# EAGLE design clock14 (EAGLE 7.7.0)
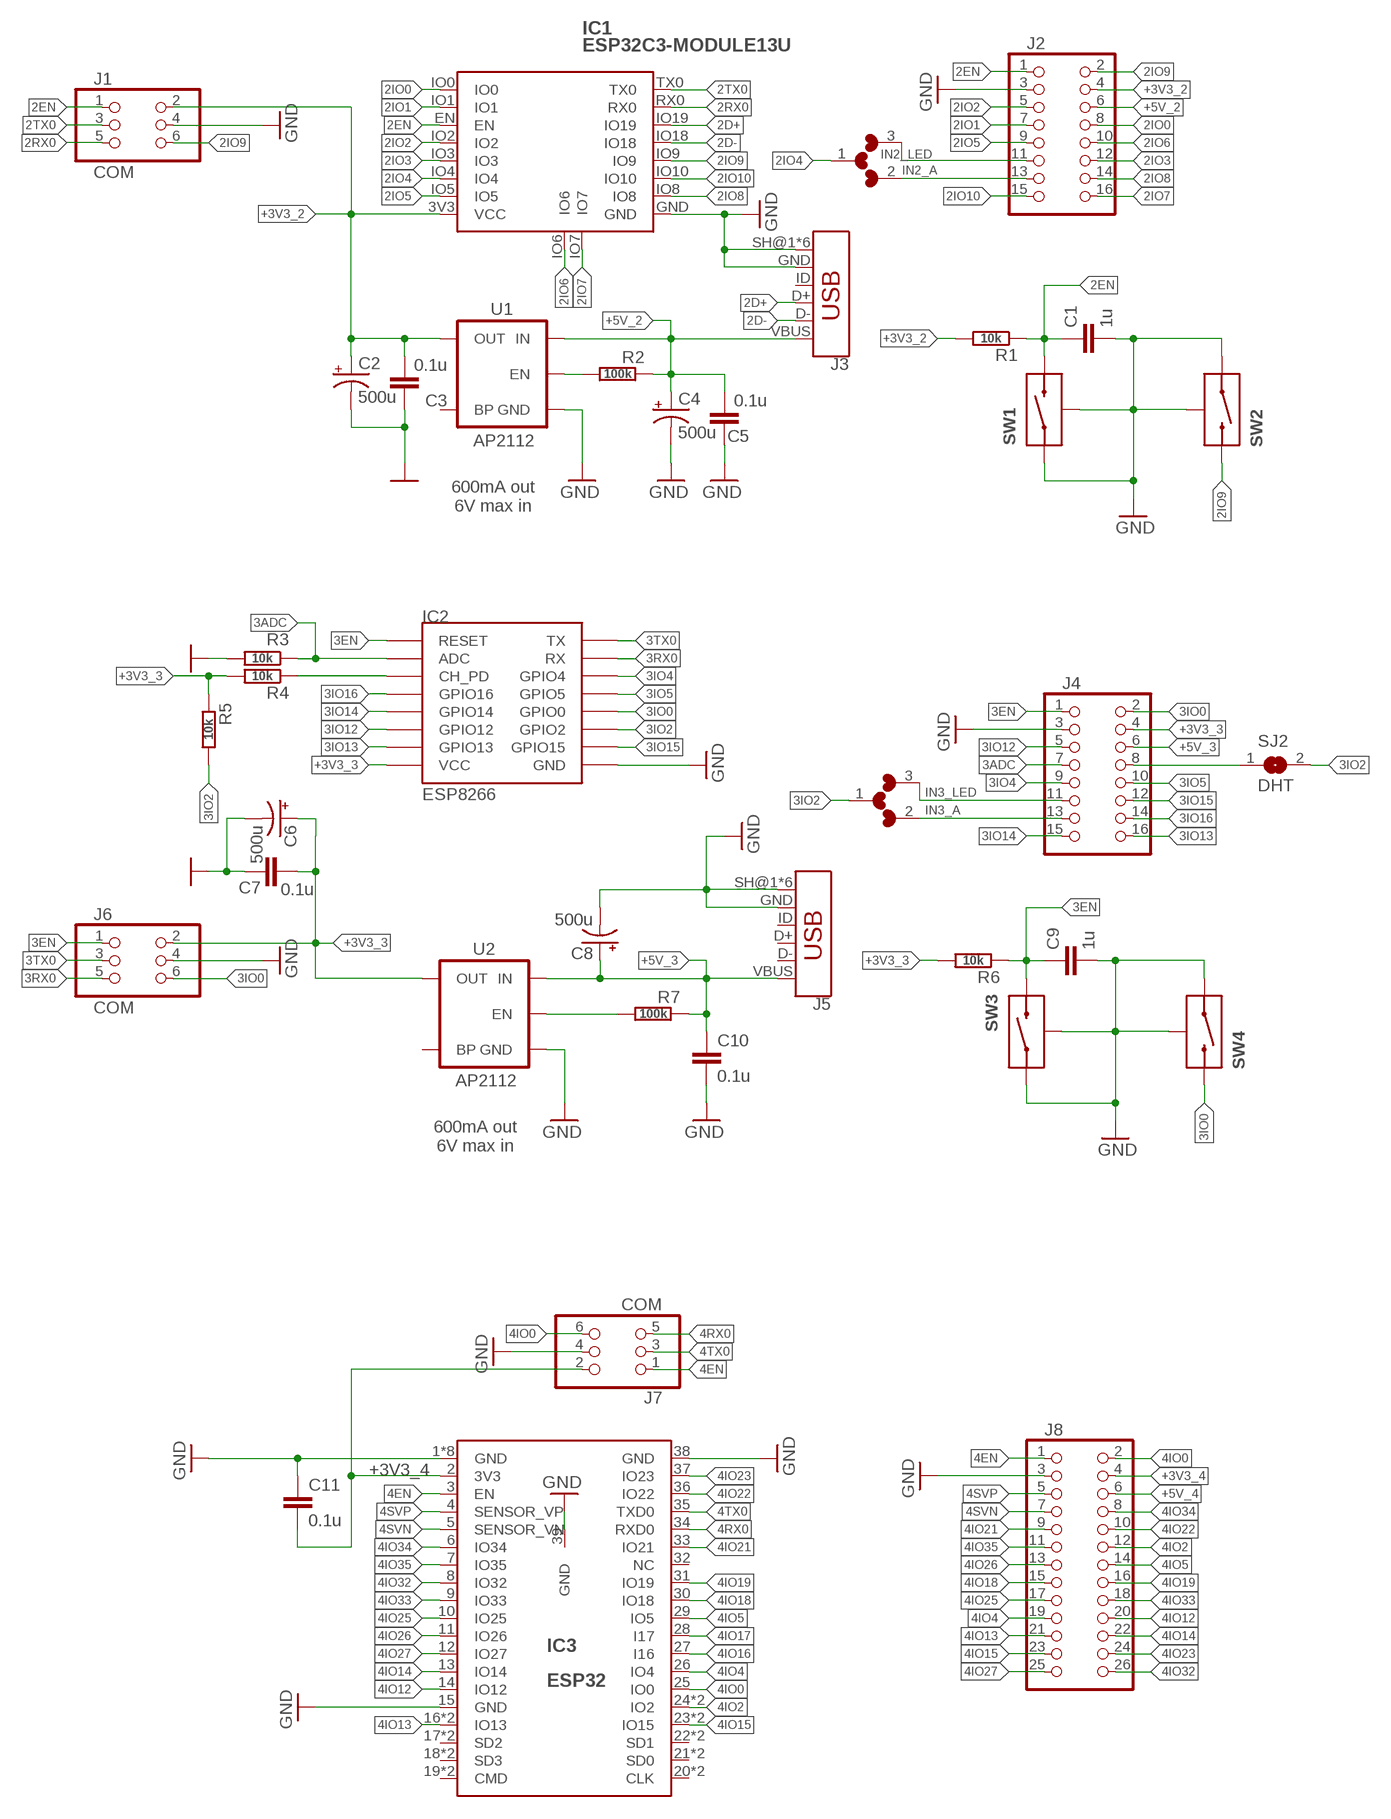
[diagram p0: schematic, sheet 1, part 1 of 2]
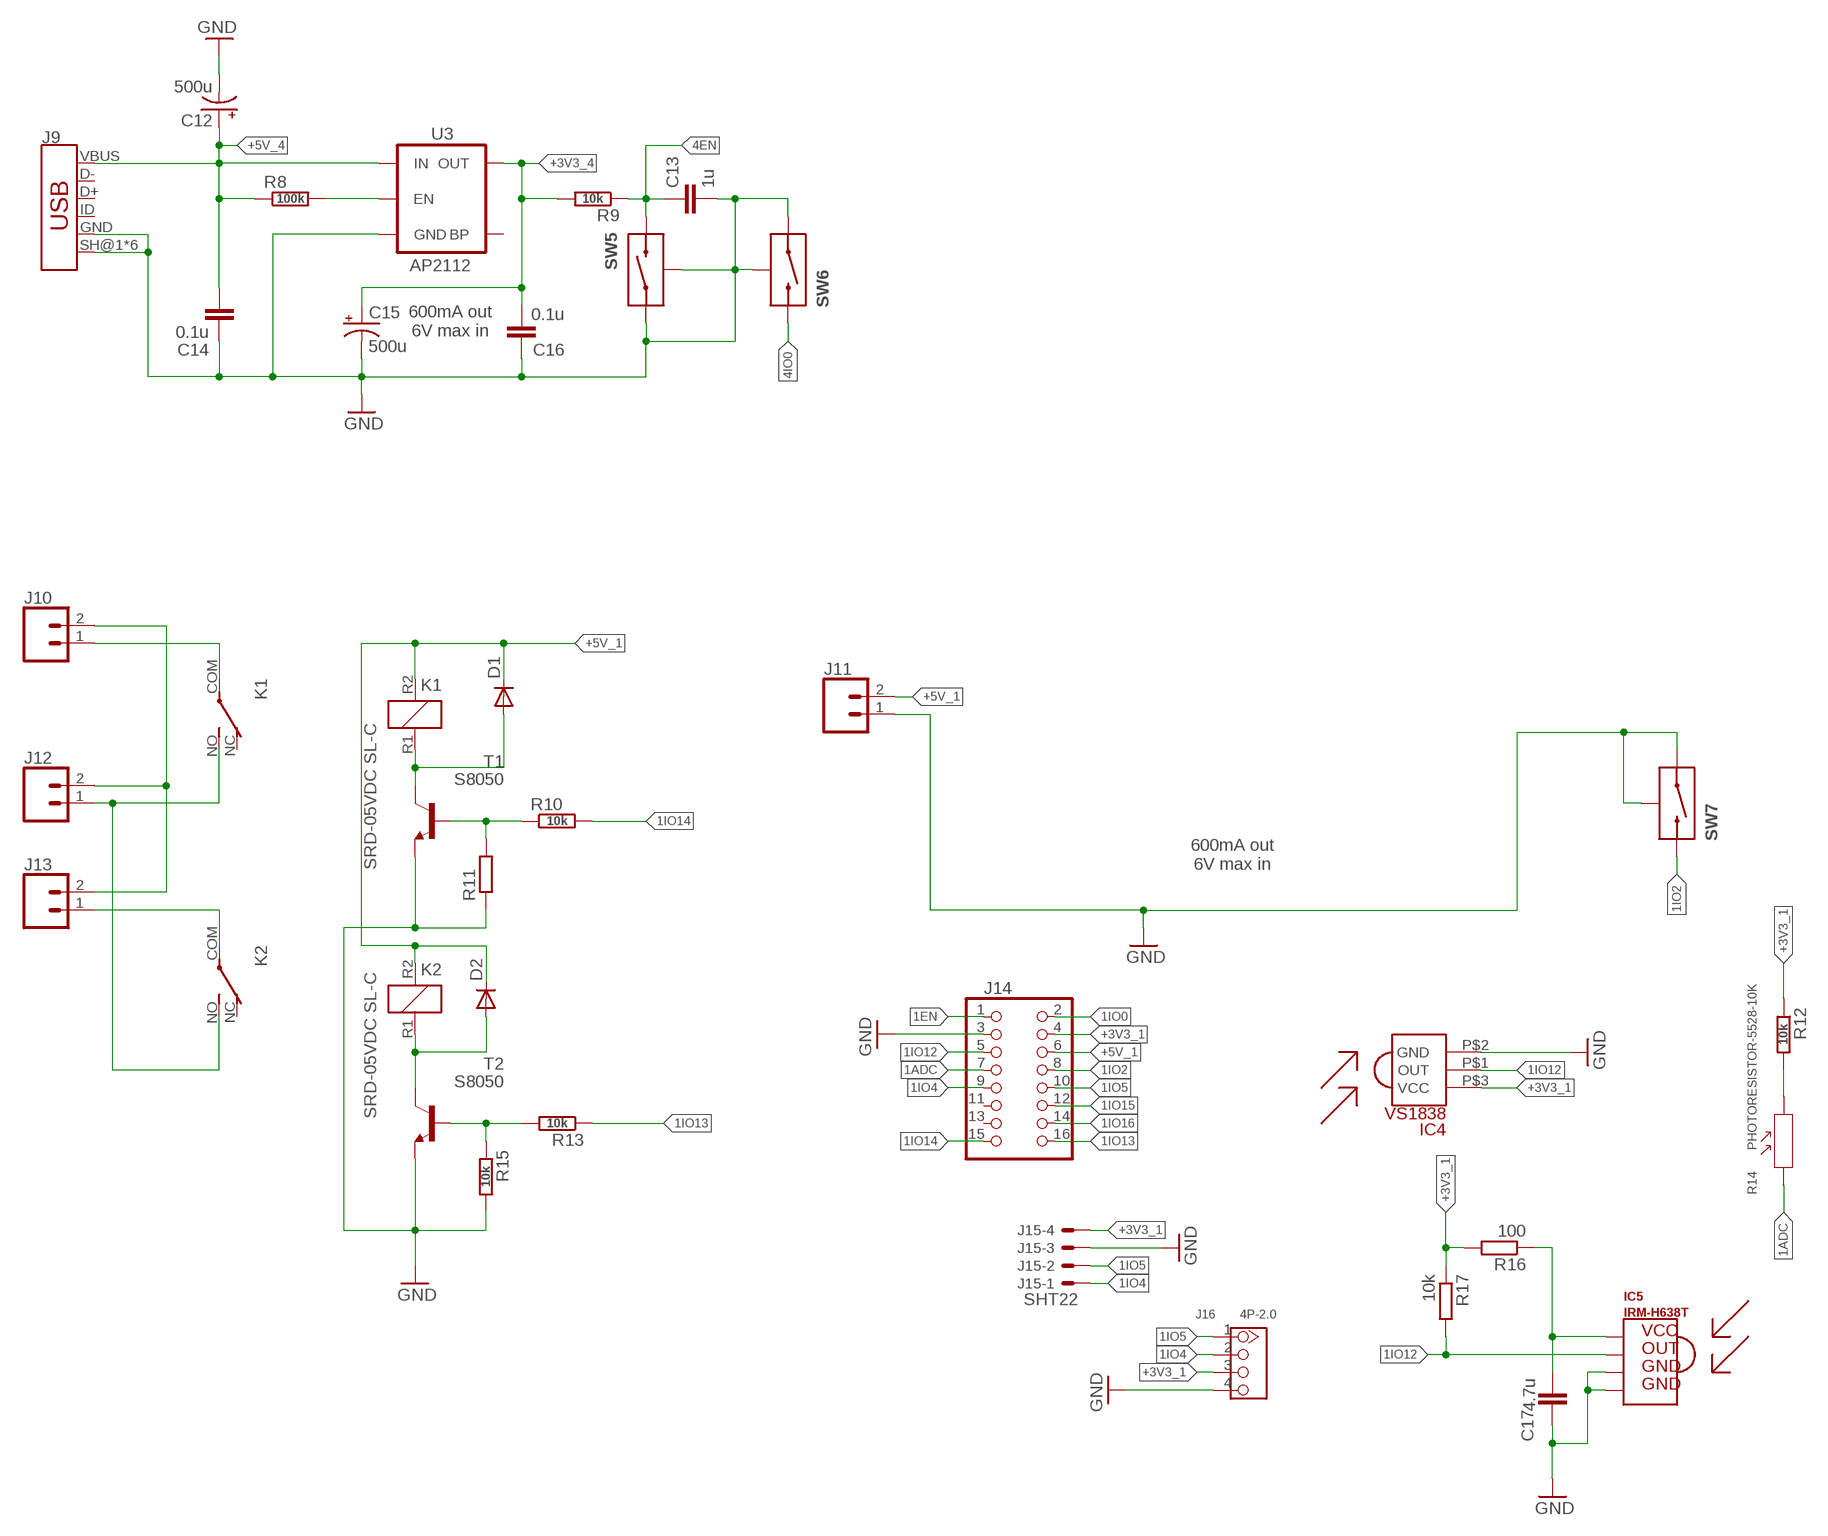
[diagram p1: schematic, sheet 1, part 2 of 2]

## Parts
C1  1u  CAP0603-CAP  [0603-CAP]
C2  500u  CAP_POLPTH1  [CPOL-RADIAL-100UF-25V]
C3  0.1u  CAP0603-CAP  [0603-CAP]
C4  500u  CAP_POLPTH1  [CPOL-RADIAL-100UF-25V]
C5  0.1u  CAP0603-CAP  [0603-CAP]
C6  500u  CAP_POLPTH1  [CPOL-RADIAL-100UF-25V]
C7  0.1u  CAP0603-CAP  [0603-CAP]
C8  500u  CAP_POLPTH1  [CPOL-RADIAL-100UF-25V]
C9  1u  CAP0603-CAP  [0603-CAP]
C10  0.1u  CAP0603-CAP  [0603-CAP]
C11  0.1u  CAP0603-CAP  [0603-CAP]
C12  500u  CAP_POLPTH1  [CPOL-RADIAL-100UF-25V]
C13  1u  CAP0603-CAP  [0603-CAP]
C14  0.1u  CAP0603-CAP  [0603-CAP]
C15  500u  CAP_POLPTH1  [CPOL-RADIAL-100UF-25V]
C16  0.1u  CAP0603-CAP  [0603-CAP]
C17  4.7u  CAP0603-CAP  [0603-CAP]
D1  DIODE-SOD123  [SOD123]
D2  DIODE-SOD123  [SOD123]
IC1  ESP32C3-MODULE13U  [ESP32C3-13U]
IC2  ESP8266  ESP12SMD  [ESP12-SMD]
IC3  ESP32  ESP32-MODULEDUAL  [ESP32-WROOVER/WROOM]
IC4  VS1838  [IR]
IC5  IRM-H638T  [IRM-H638T]
J1  COM  HEADER-2X3SMT  [2X03_SMT]
J2  HEADER-2X8  [2X8]
J3  USB_MICRO-BFEMALE_SMT_  [USB-B-MICRO-SMD_MY]
J4  HEADER-2X8  [2X8]
J5  USB_MICRO-BFEMALE_SMT_  [USB-B-MICRO-SMD_MY]
J6  COM  HEADER-2X3SMT  [2X03_SMT]
J7  COM  HEADER-2X3SMT  [2X03_SMT]
J8  HEADER-2X13  [2X13]
J9  USB_MICRO-BFEMALE_SMT_  [USB-B-MICRO-SMD_MY]
J10  CONN_02  [1X02]
J11  CONN_02  [1X02]
J12  CONN_02  [1X02]
J13  CONN_02  [1X02]
J14  HEADER-2X8  [2X8]
J15  SHT22  C-GRID-04-70543  [70543-04]
J16  4P-2.0  GROVE-CONNECTOR-DIP(4P-2.0)  [HW4-2.0]
K1  SRD-05VDC SL-C  CB1A-P-12V  [SL-C]
K2  SRD-05VDC SL-C  CB1A-P-12V  [SL-C]
R1  10k  R-EU_R0603  [R0603]
R2  100k  R-EU_R0603  [R0603]
R3  10k  R-EU_R0603  [R0603]
R4  10k  R-EU_R0603  [R0603]
R5  10k  R-EU_R0603  [R0603]
R6  10k  R-EU_R0603  [R0603]
R7  100k  R-EU_R0603  [R0603]
R8  100k  R-EU_R0603  [R0603]
R9  10k  R-EU_R0603  [R0603]
R10  10k  R-EU_R0603  [R0603]
R11  R-EU_R0603  [R0603]
R12  10k  R-EU_R0603  [R0603]
R13  10k  R-EU_R0603  [R0603]
R14  PHOTORESISTOR-5528-10K  PHOTORESISTOR-5528-10K(2P-5.0X4.2MM)  [SNR2-3.0]
R15  10k  R-EU_R0603  [R0603]
R16  100  R-EU_R0603  [R0603]
R17  10k  R-EU_R0603  [R0603]
SJ1  L/W  MICROBUILDER_SOLDERJUMPER3  [MICROBUILDER_SOLDERJUMPER_ARROW_NOPASTE_3]
SJ2  DHT  MICROBUILDER_SOLDERJUMPER  [MICROBUILDER_SOLDERJUMPER_ARROW_NOPASTE]
SJ3  L/W  MICROBUILDER_SOLDERJUMPER3  [MICROBUILDER_SOLDERJUMPER_ARROW_NOPASTE_3]
SW1  RST  MICROSWITCH-BUTTON  [MICROPUSH-BUT_TOP]
SW2  PRG  MICROSWITCH-BUTTON  [MICROPUSH-BUT_TOP]
SW3  RST  MICROSWITCH-BUTTON  [MICROPUSH-BUT_TOP]
SW4  PRG  MICROSWITCH-BUTTON  [MICROPUSH-BUT_TOP]
SW5  RST  MICROSWITCH-BUTTON  [MICROPUSH-BUT_TOP]
SW6  PRG  MICROSWITCH-BUTTON  [MICROPUSH-BUT_TOP]
SW7  PRG  MICROSWITCH-BUTTON  [MICROPUSH-BUT_TOP]
T1  S8050  -NPN-SOT23-EBC  [SOT23-EBC]
T2  S8050  -NPN-SOT23-EBC  [SOT23-EBC]
U1  AP2112  V_REG_LDOSMD  [SOT23-5]
U2  AP2112  V_REG_LDOSMD  [SOT23-5]
U3  AP2112  V_REG_LDOSMD  [SOT23-5]

## Nets
1ADC: J14.7 R14.1
1EN: J14.1
1EN_P: R8.2 U3.3(EN)
1IO0: J14.2
1IO2: J14.8 SW7.B
1IO4: J14.9 J15.1 J16.2
1IO5: J14.10 J15.2 J16.1
1IO12: IC4.P$1(OUT) IC5.OUT J14.5 R17.2
1IO13: J14.16 R13.1
1IO14: J14.15 R10.2
1IO15: J14.12
1IO16: J14.14
2D+: IC1.IO19 J3.D+
2D-: IC1.IO18 J3.D-
2EN: C1.1 IC1.EN J1.1 J2.1 R1.1 SW1.B
2EN_P: R2.2 U1.3(EN)
2IO0: IC1.IO0 J2.8
2IO1: IC1.IO1 J2.7
2IO2: IC1.IO2 J2.5
2IO3: IC1.IO3 J2.12
2IO4: IC1.IO4 SJ1.1
2IO5: IC1.IO5 J2.9
2IO6: IC1.IO6 J2.10
2IO7: IC1.IO7 J2.16
2IO8: IC1.IO8 J2.14
2IO9: IC1.IO9 J1.6 J2.2 SW2.B
2IO10: IC1.IO10 J2.15
2RX0: IC1.RX0 J1.5
2TX0: IC1.TX0 J1.3
3ADC: IC2.ADC J4.7 R3.1
3EN: C9.1 IC2.RESET J4.1 J6.1 R6.1 SW3.B
3EN_P: R7.2 U2.3(EN)
3IO0: IC2.GPIO0 J4.2 J6.6 SW4.B
3IO2: IC2.GPIO2 R5.2 SJ2.2 SJ3.1
3IO4: IC2.GPIO4 J4.9
3IO5: IC2.GPIO5 J4.10
3IO12: IC2.GPIO12 J4.5
3IO13: IC2.GPIO13 J4.16
3IO14: IC2.GPIO14 J4.15
3IO15: IC2.GPIO15 J4.12
3IO16: IC2.GPIO16 J4.14
3RX0: IC2.RXD0(RX) J6.5
3TX0: IC2.TXD0(TX) J6.3
4EN: C13.1 IC3.3(EN) J7.1 J8.1 R9.1 SW5.B
4IO0: IC3.25(IO0) J7.6 J8.2 SW6.B
4IO2: IC3.24(IO2) IC3.48(IO2) J8.12
4IO4: IC3.26(IO4) J8.19
4IO5: IC3.29(IO5) J8.14
4IO12: IC3.14(IO12) J8.20
4IO13: IC3.16(IO13) IC3.40(IO13) J8.21
4IO14: IC3.13(IO14) J8.22
4IO15: IC3.23(IO15) IC3.47(IO15) J8.23
4IO16: IC3.27(I16)
4IO17: IC3.28(I17)
4IO18: IC3.30(IO18) J8.15
4IO19: IC3.31(IO19) J8.16
4IO21: IC3.33(IO21) J8.9
4IO22: IC3.36(IO22) J8.10
4IO23: IC3.37(IO23) J8.24
4IO25: IC3.10(IO25) J8.17
4IO26: IC3.11(IO26) J8.13
4IO27: IC3.12(IO27) J8.25
4IO32: IC3.8(IO32) J8.26
4IO33: IC3.9(IO33) J8.18
4IO34: IC3.6(IO34) J8.8
4IO35: IC3.7(IO35) J8.11
4RX0: IC3.34(RXD0) J7.5
4SVN: IC3.5(SENSOR_VN) J8.7
4SVP: IC3.4(SENSOR_VP) J8.5
4TX0: IC3.35(TXD0) J7.3
+3V3_1: IC4.P$3(VCC) J14.4 J15.4 J16.3 R12.1 R16.2 R17.1
+3V3_2: C2.1(+) C3.2 IC1.3V3(VCC) J1.2 J2.4 R1.2 U1.5(OUT)
+3V3_3 [power]: C6.1(+) C7.2 IC2.VCC J4.4 J6.2 R4.2 R5.1 R6.2 U2.5(OUT)
+3V3_4: C11.2 C15.1(+) C16.2 IC3.2(3V3) J7.2 J8.4 R9.2 U3.5(OUT)
+5V_1: D1.C D2.C J11.2 J14.6 K1.R2 K2.R2
+5V_2: C4.1(+) C5.2 J2.6 J3.VBUS R2.1 U1.1(IN)
+5V_3 [power]: C8.1(+) C10.1 J4.6 J5.VBUS R7.1 U2.1(IN)
+5V_4: C12.1(+) C14.1 J8.6 J9.VBUS R8.1 U3.1(IN)
GND: C1.2 C2.2(-) C3.1 C4.2(-) C5.1 C6.2(-) C7.1 C8.2(-) C9.2 C10.2 C11.1 C12.2(-) C13.2 C14.2 C15.2(-) C16.1 C17.2 IC1.GND IC2.GND IC3.1(GND) IC3.15(GND) IC3.38(GND) IC3.39(GND) IC3.GND IC3.PAD$1(GND) IC3.PAD$4(GND) IC3.PAD$5(GND) IC3.PAD$7(GND) IC3.PAD$8(GND) IC3.PAD$9(GND) IC4.P$2(GND) IC5.GND IC5.GND1 J1.4 J2.3 J3.GND J3.SH@1(SHIELD) J3.SH@2(SHIELD) J3.SH@3(SHIELD) J3.SH@4(SHIELD) J3.SH@5(SHIELD) J3.SH@6(SHIELD) J4.3 J5.GND J5.SH@1(SHIELD) J5.SH@2(SHIELD) J5.SH@3(SHIELD) J5.SH@4(SHIELD) J5.SH@5(SHIELD) J5.SH@6(SHIELD) J6.4 J7.4 J8.3 J9.GND J9.SH@1(SHIELD) J9.SH@2(SHIELD) J9.SH@3(SHIELD) J9.SH@4(SHIELD) J9.SH@5(SHIELD) J9.SH@6(SHIELD) J11.1 J14.3 J15.3 J16.4 R3.2 R11.1 R15.2 SW1.A SW1.SH0(SH) SW2.A SW2.SH0(SH) SW3.A SW3.SH0(SH) SW4.A SW4.SH0(SH) SW5.A SW5.SH0(SH) SW6.A SW6.SH0(SH) SW7.A SW7.SH0(SH) T1.E T2.E U1.2(GND) U2.2(GND) U3.2(GND)
IN2_A: J2.13 SJ1.2
IN2_LED: J2.11 SJ1.3
IN3_A: J4.13 SJ3.2
IN3_DHT: J4.8 SJ2.1
IN3_LED: J4.11 SJ3.3
IN_L: J12.1 K1.NO(2:NO) K2.NO(2:NO)
N: J10.2 J12.2 J13.2
N$1: IC2.CH_PD R4.1
N$2: D1.A K1.R1 T1.C
N$3: R10.1 R11.2 T1.B
N$6: D2.A K2.R1 T2.C
N$7: R13.2 R15.1 T2.B
N$10: R12.2 R14.2
N$15: C17.1 IC5.VCC R16.1
OUT_L1: J10.1 K1.COM(2:COM)
OUT_L2: J13.1 K2.COM(2:COM)
Unconnected: IC3.17(SD2) IC3.18(SD3) IC3.19(CMD) IC3.20(CLK) IC3.21(SD0) IC3.22(SD1) IC3.32(NC) IC3.41(SD2) IC3.42(SD3) IC3.43(CMD) IC3.44(CLK) IC3.45(SD0) IC3.46(SD1) J3.ID J5.D+ J5.D- J5.ID J9.D+ J9.D- J9.ID J14.11 J14.13 K1.NC(2:NC) K2.NC(2:NC) U1.4(BP) U2.4(BP) U3.4(BP)

## Notes on the sheet
- 600mA out
  6V max in
- 600mA out
  6V max in
- 600mA out
  6V max in
- 600mA out
  6V max in

## Library data of the parts
C1 C3 C5 C7 C9-C11 C13 C14 C16 C17 = radiva5:CAP: Capacitor Standard 0603 ceramic capacitor, and 0.1" leaded capacitor.
C2 C4 C6 C8 C12 C15 = radiva5:CAP_POL: Capacitor Polarized These are standard SMD and PTH capacitors. Normally 10uF, 47uF, and 100uF in electrolytic and tantalum varieties. Always verify the external diameter of the through hole cap, it varies with capacity, voltage, and manufacturer. The EIA devices should be standard.
D1 D2 = radiva5:DIODE-: DIODE
IC1 = radiva5:ESP32C3-MODULE
IC2 = clock02:ESP12: ESP8266 Wifi module 12
IC3 = radiva5:ESP32-MODULE
IC4 = radiva5:VS1838
IC5 = radiva5:IRM-H638T
J1 J6 J7 = radiva5:HEADER-2X3: PIN HEADER
J2 J4 J14 = radiva5:HEADER-2X8: PIN HEADER
J3 J5 J9 = radiva5:USB_MICRO-B: USB Type Micro-B Connector Male/female and PTH/SMT variants SparkFun Products: SparkFun microB USB Breakout <?https://www.sparkfun.com/products/12035?> SparkFun USB microB Plug Breakout <?https://www.sparkfun.com/products/10031?> SparkFun ESP8266 Thing <?https://www.sparkfun.com/products/13231?>
J8 = radiva5:HEADER-2X13: PIN HEADER
J10-J13 = radiva5:CONN_02: Multi connection point. Often used as Generic Header-pin footprint for 0.1 inch spaced/style header connections On any of the 0.1 inch spaced packages, you can populate with these: Break Away Headers - Straight <https://www.sparkfun.com/products/116> (PRT-00116) Break Away Male Headers - Right Angle <https://www.sparkfun.com/products/553> (PRT-00553) Female Headers <https://www.sparkfun.com/products/115> (PRT-00115) Break Away Headers - Machine Pin <https://www.sparkfun.com/products/117> (PRT-00117) Break Away Female Headers - Swiss Machine Pin <https://www.sparkfun.com/products/743> (PRT-00743) Stackable Header - 3 Pin (Female, 0.1") <https://www.sparkfun.com/products/13875> (PRT-13875) For SCREWTERMINALS and SPRING TERMINALS visit here: Screw Terimnals on SparkFun.com <https://www.sparkfun.com/search/results?term=Screw+Terminals> (5mm/3.5mm/2.54mm spacing) This device is also useful as a general connection point to wire up your design to another part of your project. Our various solder wires solder well into these plated through hole pads. Hook-Up Wire - Assortment (Stranded, 22 AWG) <https://www.sparkfun.com/products/11375> (PRT-11375) Hook-Up Wire - Assortment (Solid Core, 22 AWG) <https://www.sparkfun.com/products/11367> (PRT-11367) View the entire wire category on our website here <https://www.sparkfun.com/categories/141> Special notes: Molex polarized connector foot print use with SKU : PRT-08232 with associated crimp pins and housings.
J15 = con-molex:C-GRID-04: CONNECTOR wire to board 2.54 mm (0.100") pitch header; OC_FARNELL: unknown; OC_NEWARK: unknown
J16 = radiva5:GROVE-CONNECTOR-DIP(4P-2.0): 320110033
K1 K2 = radiva5:CB*: HIGH POWER AUTOMOTIVE RELAY Form A NAiS Source: http://www.mew-europe.com/.. en_ds_61202_0000.pdf; MF: AROMAT/ MATSUSHITA; MPN: CB1A-P-12V; OC_FARNELL: 1270582; OC_NEWARK: 50B849
R1-R13 R15-R17 = radiva5:R-EU_: RESISTOR, European symbol
R14 = radiva5:PHOTORESISTOR-5528-10K(2P-5.0X4.2MM): 314020017; MPN: PHOTORESISTOR-5528-10K
SJ1 SJ3 = radiva5:MICROBUILDER_SOLDERJUMPER3: SMD Solder JUMPER Solder the two pads together to create a connection, or remove the solder to break it. REFLOW - Use this footprint for solder paste and reflow ovens. WAVE - Use this footprint for hand-soldering (larger pads). CLOSED - Has a trace between the two pads to ensure it is closed by default. The trace needs to be cut to disable the jumper, and can be closed again by creating a solder bridge between the two pads.
SJ2 = radiva5:MICROBUILDER_SOLDERJUMPER: SMD Solder JUMPER Solder the two pads together to create a connection, or remove the solder to break it. REFLOW - Use this footprint for solder paste and reflow ovens. WAVE - Use this footprint for hand-soldering (larger pads). CLOSED - Has a trace between the two pads to ensure it is closed by default. The trace needs to be cut to disable the jumper, and can be closed again by creating a solder bridge between the two pads.; BOM: EXCLUDE
SW1-SW7 = radiva5:MICROSWITCH-BUTTON
T1 T2 = transistor:*-NPN-: NPN Transistror BF959 corrected 2008.03.06
U1-U3 = SparkFun-PowerIC:V_REG_LDO: Voltage Regulator LDO Standard 150mA LDO voltage regulator in SOT-23 layout. Micrel part MIC5205. BP (by-pass) pin is used to lower output noise with 470pF cap.; PROD_ID: VREG-12457

## Net classes
0 default: clearance 0.205 mm
1 power: width 0.406 mm, clearance 0.205 mm to class 0, clearance 0.205 mm

## Board
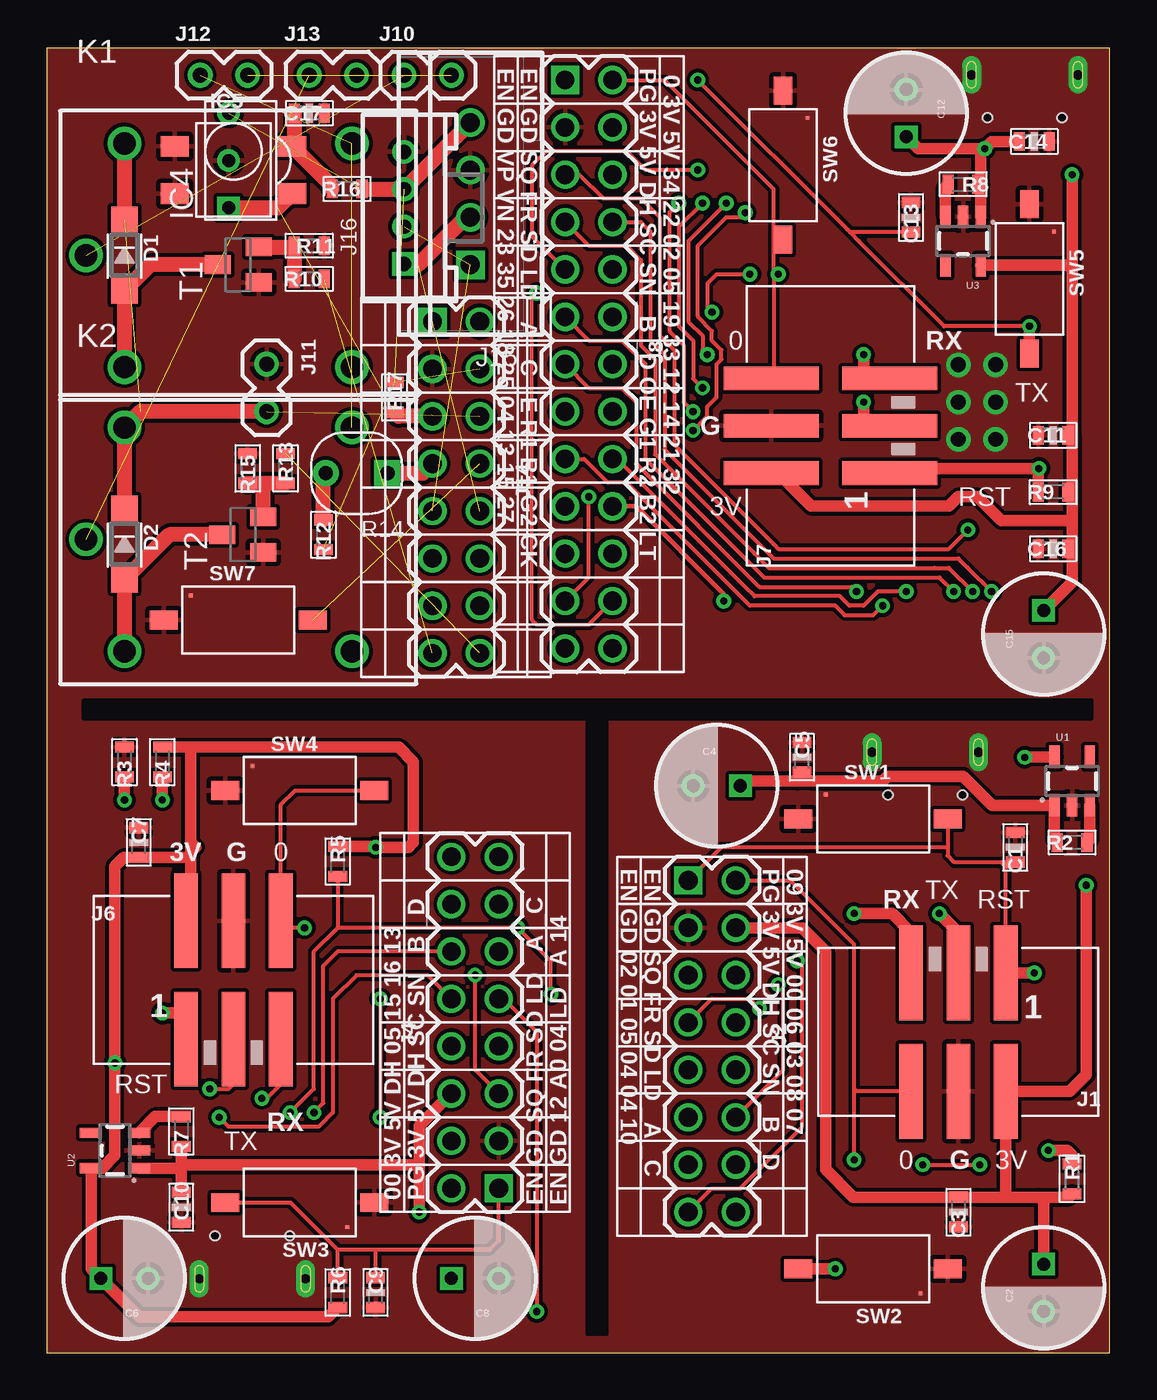
[diagram p2: board, top side]
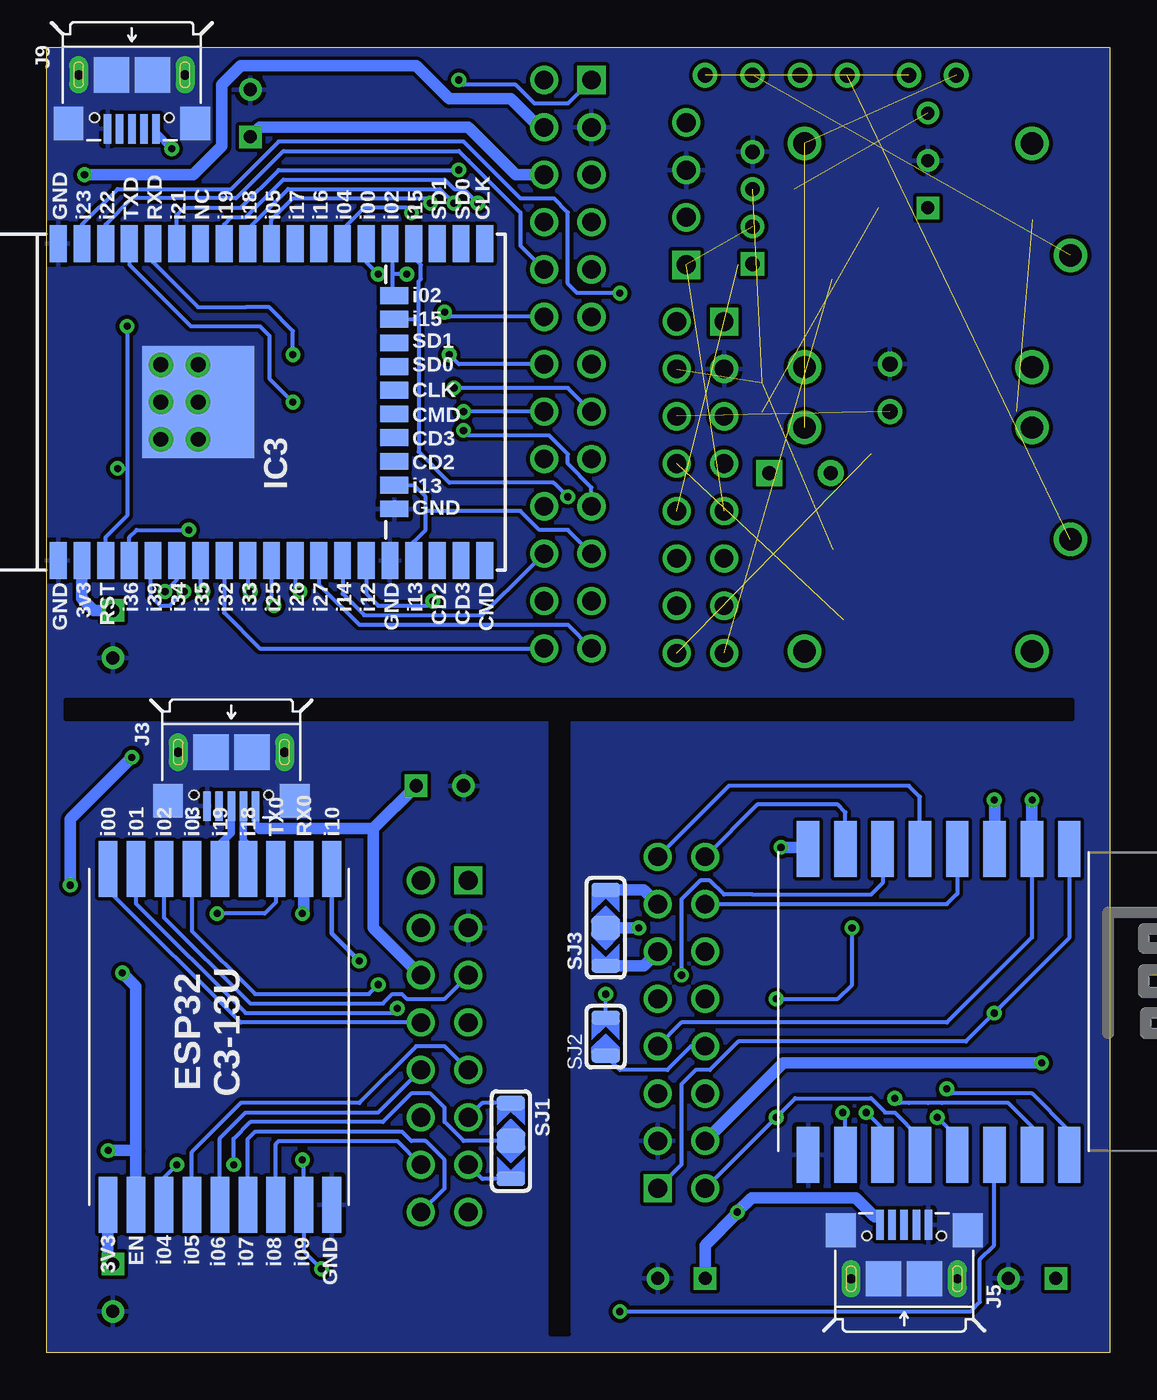
[diagram p3: board, bottom side, seen from below]

Size 57 x 70 mm. Coordinates in mm from the lower left corner, seen from the top.
Outline: 0,70 0,0 57,0 57,70 0,70
Copper layers (1*16): Top 0.035mm / dielectric 1.5mm / Bottom 0.035mm
Design rules "default *": minimum track width 8mil, minimum drill 15mil, track to track 8mil, track to pad 8mil, pad to pad 8mil, via to via 8mil, smd to smd 8mil, copper to edge 1mil, drill to drill 8mil, minimum pad ring 10mil, minimum via ring 8mil, stop-mask expansion 4mil, vias tented up to drill 20mil, thermal gap 10mil

### Footprints (pad centres in the part's own frame; a part is rotated, then mirrored left to right if it is on the bottom)
0603-CAP = smd 0.6 x 1: 1 -0.8,0; 2 0.8,0
CPOL-RADIAL-100UF-25V = drill 0.7 square: 1 1.27,0 | drill 0.7: 2 -1.27,0
SOD123 = smd 1.4 x 1.4: A 1.9,0; C -1.9,0
ESP32C3-13U = smd 3 x 1: 3V3 -9,5.6; EN -9,4.1; GND -9,-6.4; IO0 9,5.6; IO1 9,4.1; IO2 9,2.6; IO3 9,1.1; IO4 -9,2.6; IO5 -9,1.1; IO6 -9,-0.4; IO7 -9,-1.9; IO8 -9,-3.4; IO9 -9,-4.9; IO10 9,-6.4; IO18 9,-1.9; IO19 9,-0.4; RX0 9,-4.9; TX0 9,-3.4
ESP12-SMD = smd 3 x 1.2: ADC -8.3,3.8; CH_PD -8.3,1.8; GND 8.1,-8.2; GPIO0 8.1,-2.2; GPIO2 8.1,-4.2; GPIO4 8.1,1.8; GPIO5 8.1,-0.2; GPIO12 -8.3,-4.2; GPIO13 -8.3,-6.2; GPIO14 -8.3,-2.2; GPIO15 8.1,-6.2; GPIO16 -8.3,-0.2; RESET -8.3,5.8; RXD0 8.1,3.8; TXD0 8.1,5.8; VCC -8.3,-8.2
ESP32-WROOVER/WROOM = smd 2 x 0.9: 1 -8.5,7.5; 2 -8.5,6.23; 3 -8.5,4.96; 4 -8.5,3.69; 5 -8.5,2.42; 6 -8.5,1.15; 7 -8.5,-0.12; 8 -8.5,-1.39; 9 -8.5,-2.66; 10 -8.5,-3.93; 11 -8.5,-5.2; 12 -8.5,-6.47; 13 -8.5,-7.74; 14 -8.5,-9.01; 15 -8.5,-10.28; 16 -8.5,-11.55; 17 -8.5,-12.82; 18 -8.5,-14.09; 19 -8.5,-15.36; 20 8.5,-15.36; 21 8.5,-14.09; 22 8.5,-12.82; 23 8.5,-11.55; 24 8.5,-10.28; 25 8.5,-9.01; 26 8.5,-7.74; 27 8.5,-6.47; 28 8.5,-5.2; 29 8.5,-3.93; 30 8.5,-2.66; 31 8.5,-1.39; 32 8.5,-0.12; 33 8.5,1.15; 34 8.5,2.42; 35 8.5,3.69; 36 8.5,4.96; 37 8.5,6.23; 38 8.5,7.5 | smd 0.9 x 1.5: 39 -5.725,-10.5; 40 -4.445,-10.5; 41 -3.175,-10.5; 42 -1.905,-10.5; 43 -0.635,-10.5; 44 0.635,-10.5; 45 1.905,-10.5; 46 3.175,-10.5; 47 4.445,-10.5; 48 5.715,-10.5 | smd 6 x 6: GND 0,0 | drill 0.8: PAD$1 -2,2; PAD$4 0,2; PAD$5 2,2; PAD$7 -2,0; PAD$8 0,0; PAD$9 2,0
IR = drill 0.7 pad 1 square: P$1 -2.54,0 | drill 0.7 pad 1: P$2 0,0; P$3 2.54,0
IRM-H638T = smd 1.5 x 1.1: GND -3.15,-1.27; GND1 -3.15,1.27; OUT 3.15,-1.27; VCC 3.15,1.27
2X03_SMT = smd 1.27 x 5.08: 1 -2.54,-3.175; 2 -2.54,3.175; 3 0,-3.175; 4 0,3.175; 5 2.54,-3.175; 6 2.54,3.175
2X8 = drill 1 square: 1 -8.89,-1.27 | drill 1: 2 -8.89,1.27; 3 -6.35,-1.27; 4 -6.35,1.27; 5 -3.81,-1.27; 6 -3.81,1.27; 7 -1.27,-1.27; 8 -1.27,1.27; 9 1.27,-1.27; 10 1.27,1.27; 11 3.81,-1.27; 12 3.81,1.27; 13 6.35,-1.27; 14 6.35,1.27; 15 8.89,-1.27; 16 8.89,1.27
USB-B-MICRO-SMD_MY = smd 1.6 x 0.4: D+ -4.4,0; D- -4.4,-0.65; GND -4.4,1.3; ID -4.4,0.65; VBUS -4.4,-1.3 | drill 0.5 long: SH@1 -1.5,-2.85; SH@2 -1.5,2.85 | smd 1.9 x 1.9: SH@3 -1.5,-1.1; SH@4 -1.5,1.1 | smd 1.8 x 1.6: SH@5 -4.1,-3.4; SH@6 -4.1,3.4 | hole 0.5: -3.8,-2; -3.8,2
2X13 = drill 1 square: 1 -15.24,-1.27 | drill 1: 2 -15.24,1.27; 3 -12.7,-1.27; 4 -12.7,1.27; 5 -10.16,-1.27; 6 -10.16,1.27; 7 -7.62,-1.27; 8 -7.62,1.27; 9 -5.08,-1.27; 10 -5.08,1.27; 11 -2.54,-1.27; 12 -2.54,1.27; 13 0,-1.27; 14 0,1.27; 15 2.54,-1.27; 16 2.54,1.27; 17 5.08,-1.27; 18 5.08,1.27; 19 7.62,-1.27; 20 7.62,1.27; 21 10.16,-1.27; 22 10.16,1.27; 23 12.7,-1.27; 24 12.7,1.27; 25 15.24,-1.27; 26 15.24,1.27
1X02 = drill 0.813: 1 0,0; 2 2.54,0
70543-04 = drill 1.016 square: 1 -3.81,0 | drill 1.016: 2 -1.27,0; 3 1.27,0; 4 3.81,0
HW4-2.0 = drill 0.762 pad 1.27 square: 1 -3,0 | drill 0.762 pad 1.27: 2 -1,0; 3 1,0; 4 3,0
SL-C = drill 1.2: COM -8.15,0; NC 6.1,-6; NO 6.1,6; R1 -6.1,-6; R2 -6.1,6
R0603 = smd 0.6 x 1: 1 -0.8,0; 2 0.8,0
SNR2-3.0 = drill 0.762 pad 1.397 square: 1 -1.651,0 | drill 0.762 pad 1.397: 2 1.651,0
MICROBUILDER_SOLDERJUMPER_ARROW_NOPASTE_3 = smd 1.27 x 1.524: 1 0,0 | smd 0.762 x 1.524: 2 2.032,0; 3 -2.032,0
MICROBUILDER_SOLDERJUMPER_ARROW_NOPASTE = smd 0.762 x 1.524: 1 -1.016,0; 2 1.016,0
MICROPUSH-BUT_TOP = smd 1.5 x 1: A -4,0; B 4,0 | smd 0.2 x 0.2: SH0 -2.54,1.31
SOT23-EBC = smd 1 x 1.4: B 0.95,-1.1; C 0,1.1; E -0.95,-1.1
SOT23-5 = smd 0.55 x 1.2: 1 -0.95,-1.3; 2 0,-1.3; 3 0.95,-1.3; 4 0.95,1.3; 5 -0.95,1.3

### Placement (x,y rotation side)
C1  51.92,27.11 90 top
C2  53.45,3.49 90 top
C3  48.88,7.55 90 top
C4  35.92,30.41 0 top
C5  40.49,31.94 270 top
C6  4.17,4 180 top
C7  4.93,27.37 270 top
C8  22.97,4 180 top
C9  17.63,3.24 270 top
C10  7.22,7.81 270 top
C11  53.96,49.21 0 top
C12  46.08,66.48 270 top
C13  46.34,60.89 90 top
C14  52.94,64.96 0 top
C15  53.45,38.54 90 top
C16  53.96,43.11 0 top
C17  14.08,66.48 0 top
D1  4.17,58.86 270 top
D2  4.17,43.37 270 top
IC1  48.11,16.95 90 bottom
IC2  7.98,18.73 270 bottom
IC3  48.88,50.99 90 bottom
IC4  9.76,63.94 90 top
IC5  10.01,63.43 0 top
J1  48.88,17.21 180 top
J2  35.67,16.44 270 top
J3  47.1,33.72 90 bottom
J4  22.97,17.71 90 top
J5  11.03,2.47 270 bottom
J6  10.01,20 0 top
J7  42.02,49.72 90 top
J8  29.06,53.02 270 top
J9  52.43,70.04 90 bottom
J10  19.16,68.51 0 top
J11  11.79,53.02 270 top
J12  8.24,68.51 0 top
J13  14.08,68.51 0 top
J14  21.95,46.42 270 top
J15  22.71,62.16 90 top
J16  19.16,61.4 90 top
K1  10.27,58.86 0 top
K2  10.27,43.62 0 top
R1  54.97,9.33 270 top
R2  54.97,27.37 0 top
R3  4.17,31.68 90 top
R4  6.2,31.68 90 top
R5  15.6,26.35 270 top
R6  15.6,3.24 270 top
R7  7.22,11.87 90 top
R8  49.13,62.67 180 top
R9  53.96,46.16 0 top
R10  14.08,57.59 0 top
R11  14.08,59.37 180 top
R12  14.84,43.88 90 top
R13  12.81,47.43 270 top
R14  16.62,47.18 180 top
R15  10.78,47.43 90 top
R16  16.11,62.42 0 top
R17  18.65,51.24 270 top
SJ1  32.11,11.36 270 bottom
SJ2  27.03,16.95 90 bottom
SJ3  27.03,22.79 90 bottom
SW1  44.3,28.64 0 top
SW2  44.3,4.51 180 top
SW3  13.57,8.06 180 top
SW4  13.57,30.16 0 top
SW5  52.69,57.59 270 top
SW6  39.48,63.69 270 top
SW7  10.27,39.3 0 top
T1  10.27,58.35 90 top
T2  10.52,43.88 90 top
U1  54.97,30.67 0 top
U2  3.66,10.86 90 top
U3  49.13,59.62 180 top

### Tracks (layer width: path | path; a pad name or v marks a point on that pad's centre or on a via)
1ADC
  Top 0.813: R14.1 20.17,47.18 J14.7
1EN_P
  Top 0.61: U3.3 48.18,62.52 R8.2
1IO2  (1 unrouted)
1IO4  (2 unrouted)
1IO5  (1 unrouted)
  Top 0.813: J15.2 22.46,60.89 19.92,58.35 19.21,58.35 J16.1
1IO12  (1 unrouted)
  Top 0.813: IC4.P$1 12.4,61.4 IC5.OUT | J14.5 18.87,50.23 R17.2
1IO13  (1 unrouted)
1IO14  (1 unrouted)
2D+
  Bottom 0.406: J3.D+ 47.1,27.87 47.71,27.26 IC1.IO19
2D-
  Bottom 0.406: J3.D- 46.45,27.48 46.21,27.24 IC1.IO18
2EN  (via drill 0.38)
  Top 0.203: SW1.B 48.3,27.11 | 48.3,27.11 48.3,26.67 48.66,26.31 51.16,26.31 | 48.3,27.11 36.18,27.11 J2.1 | C1.1 51.16,26.31 | J1.1 51.42,26.06 51.16,26.31
  Top 0.61: J1.1 v52.94,20.38 | R1.1 54.97,10.6 54.72,10.86 v53.7,10.86
  Bottom 0.61: IC1.EN 52.21,10.86 | 52.21,10.86 52.21,19.66 v52.94,20.38 | v53.7,10.86 52.21,10.86
2EN_P
  Top 0.61: U1.3 55.92,27.52 R2.2
2IO0
  Bottom 0.203: IC1.IO0 53.71,24.84 46.59,17.71 J2.8
2IO1  (via drill 0.38)
  Top 0.203: J2.7 35.67,18.98 37.7,18.98 v38.21,18.48
  Bottom 0.203: IC1.IO1 52.21,24.1 46.34,18.22 38.46,18.22 v38.21,18.48
2IO2
  Bottom 0.203: IC1.IO2 50.71,23.36 46.08,18.73 38.97,18.73 38.46,19.24 37.95,19.24 37.7,18.98 35.67,18.98 J2.5
2IO3  (via drill 0.38)
  Top 0.203: J2.12 39.48,15.17 39.48,19.49 v39.22,19.75
  Bottom 0.203: IC1.IO3 49.21,22.62 45.83,19.24 39.73,19.24 v39.22,19.75
2IO4  (via drill 0.38)
  Top 0.203: v46.97,10.09 v50.02,10.09
  Bottom 0.203: IC1.IO4 50.71,9.4 v50.02,10.09 | v46.97,10.09 46.97,11.49 46.08,12.38 38.97,12.38 37.45,13.9 36.43,13.9 35.67,13.14 35.67,12.38 34.65,11.36 SJ1.1
2IO5
  Bottom 0.203: J2.9 35.67,16.44 37.19,16.44 40.24,13.4 46.59,13.4 49.21,10.77 IC1.IO5
2IO6
  Bottom 0.203: J2.10 39.22,12.89 46.34,12.89 47.71,11.51 IC1.IO6
2IO7
  Bottom 0.203: IC1.IO7 46.21,11.49 45.83,11.87 37.95,11.87 37.45,11.36 36.68,11.36 35.67,10.35 35.67,8.82 J2.16
2IO8
  Bottom 0.203: IC1.IO8 44.71,11.21 44.56,11.36 38.21,11.36 J2.14
2IO9  (via drill 0.38)
  Top 0.203: v43.29,10.35 43.29,14.16 | 43.29,14.16 43.29,21.91 39.86,25.33 J2.2 | J1.6 43.41,14.03 43.29,14.16
  Top 0.61: SW2.B v42.27,4.51
  Bottom 0.203: v43.29,10.35 43.21,10.27 IC1.IO9 43.21,5.45 v42.27,4.51
2IO10  (via drill 0.38)
  Top 0.203: J2.15 35.67,8.82 37.19,8.82 40.49,12.13 40.49,20.76 v40.24,21.02
  Bottom 0.254: IC1.IO10 41.71,22.49 v40.24,21.02
2RX0  (via drill 0.38)
  Top 0.61: v43.29,23.56 45.32,23.56 46.34,22.54 J1.5
  Bottom 0.203: 43.21,23.63 v43.29,23.56
  Bottom 0.61: IC1.RX0 43.21,23.63
2TX0  (via drill 0.38)
  Top 0.61: J1.3 48.88,22.54 v47.86,23.56
  Bottom 0.203: IC1.TX0 44.71,24.16 45.32,23.56 v47.86,23.56
3ADC  (via drill 0.38)
  Top 0.61: v4.17,29.65 R3.1
  Bottom 0.203: IC2.ADC 4.18,22.28 8.74,17.71 22.97,17.71 J4.7
  Bottom 0.61: IC2.ADC 4.18,29.64 v4.17,29.65
3EN  (via drill 0.38)
  Top 0.203: J4.1 24.24,6.03 23.73,5.52 17.63,5.52 | 17.63,5.52 15.6,5.52 | C9.1 17.63,5.52 | R6.1 15.6,5.52 | SW3.B 13.06,8.06 15.6,5.52
  Top 0.61: v6.2,18.22 7.47,18.22 J6.1
  Bottom 0.203: IC2.RESET 2.18,22.24 v6.2,18.22 7.73,16.7 19.92,16.7 21.44,15.17 22.21,15.17 22.97,14.41 22.97,10.09 J4.1
3EN_P
  Top 0.61: R7.2 5.83,12.67 U2.3
3IO0  (via drill 0.38)
  Top 0.203: J6.6 12.55,23.56 | v17.89,18.98 v17.89,12.63 | v13.82,22.79 12.94,22.79 J6.6 | J6.6 12.55,29.4 13.32,30.16 SW4.B
  Bottom 0.203: J4.2 v17.89,12.63 16.87,13.65 12.81,13.65 12.05,12.89 11.54,12.89 10.18,11.53 IC2.GPIO0 | v17.89,18.98 14.59,18.98 13.82,19.75 v13.82,22.79
3IO2  (via drill 0.38)
  Top 0.203: v27.03,19.24 27.03,21.02 v25.25,22.79 15.6,22.79 | v13.06,12.89 14.33,14.16 14.33,21.52 15.6,22.79 | R5.2 15.6,22.79
  Bottom 0.203: SJ2.2 v27.03,19.24 | IC2.GPIO2 12.18,12.01 v13.06,12.89
  Bottom 0.61: SJ3.1 v25.25,22.79
3IO4  (via drill 0.38)
  Top 0.203: J4.9 24.49,18.98 26.27,17.21 v26.27,2.22
  Bottom 0.203: v26.27,2.22 7.47,2.22 6.97,2.73 6.97,5.01 6.2,5.78 6.2,10.61 IC2.GPIO4
3IO5  (via drill 0.38)
  Top 0.203: v9.25,12.63 9.76,12.13 14.59,12.13 15.35,12.89 15.35,18.98 16.62,20.25 20.43,20.25 J4.10
  Bottom 0.203: IC2.GPIO5 8.18,11.56 v9.25,12.63
3IO12  (via drill 0.38)
  Top 0.203: J4.5 22.97,15.17 v22.97,20.25
  Bottom 0.203: IC2.GPIO12 12.18,25.2 12.3,25.08 12.81,24.57 19.16,24.57 20.68,24.57 21.44,25.33 21.95,25.33 22.97,24.32 v22.97,20.25
3IO13
  Bottom 0.203: IC2.GPIO13 14.18,28.99 14.59,29.4 18.9,29.4 J4.16
3IO14
  Bottom 0.203: IC2.GPIO14 10.18,29.82 10.78,30.41 20.43,30.41 J4.15
3IO15  (via drill 0.38)
  Top 0.203: v14.33,12.89 14.84,13.4 14.84,20.76 15.6,21.52 J4.12
  Bottom 0.203: IC2.GPIO15 14.18,12.74 v14.33,12.89
3IO16
  Bottom 0.203: J4.14 8.74,24.06 8.24,24.57 8.18,24.63 IC2.GPIO16
3RX0  (via drill 0.38)
  Top 0.203: J6.5 12.55,14.41 11.79,13.65 v11.54,13.65
  Bottom 0.203: v11.54,13.65 11.28,13.4 10.78,13.4 9.76,13.4 9,13.4 5.44,13.4 4.18,12.14 IC2.RXD0
3TX0  (via drill 0.38)
  Top 0.203: J6.3 10.01,14.92 10.01,14.41 9.76,14.16 v8.74,14.16
  Bottom 0.203: IC2.TXD0 2.18,11.91 4.17,13.9 8.49,13.9 v8.74,14.16
4EN  (via drill 0.38)
  Top 0.203: 43.07,60.09 42.91,60.26 | 42.91,60.26 v34.91,68.26 | 43.07,60.09 43.54,59.62 48.11,55.05 v52.69,55.05 | C13.1 43.07,60.09 | 43.07,60.09 42.91,60.26
  Top 0.61: R9.1 53.16,47.39 v53.19,47.43 46.08,47.43 45.83,47.18 J7.1 | SW5.B v52.69,55.05
  Bottom 0.203: IC3.3 53.84,43.74 52.69,44.89 52.69,47.43 | v52.69,55.05 52.69,47.43 | J8.1 29.06,66.99 30.84,66.99 31.86,68.01 34.65,68.01 v34.91,68.26 | v53.19,47.43 52.69,47.43
4IO0  (via drill 0.38)
  Top 0.203: v39.22,57.85 38.97,57.85 | 38.97,57.85 38.97,59.62 | 38.97,59.62 38.97,59.75 38.97,62.42 33.13,68.26 J8.2 | 38.97,57.85 38.97,52.38 J7.6 | SW6.B 39.03,59.69 38.97,59.62
  Bottom 0.203: IC3.25 39.87,58.49 v39.22,57.85
4IO2  (via drill 0.38)
  Top 0.203: v37.7,57.85 35.92,57.85 35.41,57.34 35.41,56.07 v35.67,55.81
  Bottom 0.203: IC3.24 38.58,59.49 38.46,59.37 38.46,57.85 | 38.46,57.85 38.46,56.79 IC3.48 | v37.7,57.85 38.46,57.85 | J8.12 35.41,55.56 v35.67,55.81
4IO4  (via drill 0.38)
  Top 0.203: v34.65,49.46 35.41,50.23 35.41,50.73 35.92,51.24 35.92,53.02 36.18,53.27 36.18,53.78 35.67,54.29 35.67,54.8 34.91,55.56 34.91,59.37 36.43,60.89 37.19,60.89 v37.45,61.15
  Bottom 0.203: v34.65,49.46 34.4,49.21 30.08,49.21 29.06,48.19 29.06,47.69 27.79,46.42 J8.19 | v37.45,61.15 37.7,61.4 39.99,61.4 41,60.39 41.14,60.25 IC3.26
4IO5  (via drill 0.38)
  Top 0.203: v36.43,61.66 34.4,59.62 34.4,55.31 35.16,54.54 35.16,53.78 v35.41,53.53
  Bottom 0.203: IC3.29 44.95,60.76 43.8,61.91 36.68,61.91 v36.43,61.66 | J8.14 34.91,53.02 v35.41,53.53
4IO12  (via drill 0.38)
  Top 0.254: J8.20 31.6,45.4 36.3,40.7 v36.3,40.32
  Bottom 0.203: IC3.14 39.87,40.71 39.22,40.07 36.56,40.07 v36.3,40.32
4IO13
  Bottom 0.203: IC3.16 37.33,43.49 36.68,44.13 36.68,45.15 | 36.68,45.15 36.68,45.91 37.32,46.54 IC3.40 | J8.21 29.06,44.13 30.59,44.13 31.6,45.15 36.68,45.15
4IO14
  Bottom 0.203: IC3.13 41.14,40.71 39.99,39.56 33.64,39.56 31.1,42.1 J8.22
4IO15  (via drill 0.38)
  Top 0.203: J8.23 29.06,41.59 v29.06,45.91
  Bottom 0.203: 37.19,59.37 37.33,59.5 IC3.23 37.33,58.74 36.94,58.35 36.94,57.59 37.06,57.47 37.06,55.43 | IC3.47 37.06,55.43 | v29.06,45.91 29.83,46.67 35.41,46.67 37.06,48.32 37.06,55.43
4IO18  (via drill 0.38)
  Top 0.203: v35.16,61.66 33.89,60.39 33.89,55.05 34.65,54.29 34.65,52.26 v35.16,51.75
  Bottom 0.203: IC3.30 46.22,60.25 44.05,62.42 35.92,62.42 v35.16,61.66 | J8.15 29.06,51.75 34.4,51.75 v35.16,51.75
4IO19  (via drill 0.38)
  Top 0.203: v33.89,61.66 33.38,61.15 33.38,54.8 34.14,54.04 34.14,50.99 v34.65,50.48
  Bottom 0.203: J8.16 v34.65,50.48 | IC3.31 47.49,60.51 47.1,60.89 46.34,60.89 44.3,62.93 35.67,62.93 35.16,62.42 34.65,62.42 v33.89,61.66
4IO21  (via drill 0.38)
  Top 0.203: v34.91,63.43 32.11,63.43 31.1,64.45 26.78,64.45 26.02,63.69 26.02,59.88 J8.9
  Bottom 0.203: IC3.33 50.03,61.01 49.64,61.4 46.59,61.4 44.56,63.43 v34.91,63.43
4IO22
  Bottom 0.203: J8.10 31.35,59.12 31.6,59.37 31.6,61.15 34.4,63.94 34.91,64.45 44.3,64.45 44.81,63.94 46.84,61.91 52.43,61.91 53.84,60.51 IC3.36
4IO23  (via drill 0.38)
  Top 0.203: v26.27,56.83 26.02,56.58 26.02,39.3 26.27,39.05 29.06,39.05 J8.24
  Bottom 0.203: IC3.37 55.11,60.51 53.19,62.42 47.1,62.42 44.56,64.96 34.65,64.96 31.6,61.91 29.83,61.91 29.06,61.15 29.06,57.34 28.56,56.83 v26.27,56.83
4IO25  (via drill 0.38)
  Top 0.203: v44.81,40.07 44.3,39.56 42.78,39.56 42.27,40.07 37.7,40.07 37.19,40.57 31.1,46.67 30.08,46.67 28.81,47.94 J8.17
  Bottom 0.203: IC3.10 44.95,40.2 v44.81,40.07
4IO26  (via drill 0.38)
  Top 0.203: J8.13 29.06,51.75 30.84,51.75 31.6,50.99 31.6,47.69 38.21,41.08 43.16,41.08 v43.41,40.83
  Bottom 0.203: IC3.11 43.68,41.09 v43.41,40.83
4IO27
  Bottom 0.203: IC3.12 42.41,41.22 40.24,39.05 29.06,39.05 J8.25
4IO32
  Bottom 0.203: IC3.8 47.49,39.69 45.57,37.78 J8.26
4IO33  (via drill 0.38)
  Top 0.203: J8.18 30.59,47.94 37.45,41.08 37.95,40.57 42.53,40.57 43.03,40.07 43.8,40.07 44.56,40.83 v46.08,40.83
  Bottom 0.203: IC3.9 46.22,40.96 v46.08,40.83
4IO34  (via drill 0.38)
  Top 0.203: J8.8 31.86,60.64 32.37,60.13 32.37,54.29 33.13,53.53 33.13,48.45 37.95,43.62 38.97,42.61 48.88,42.61 49.38,42.1 v50.65,40.83
  Bottom 0.203: IC3.6 50.03,41.46 v50.65,40.83
4IO35  (via drill 0.38)
  Top 0.203: v48.62,40.83 47.86,41.59 38.46,41.59 32.11,47.94 32.11,53.02 30.84,54.29 29.06,54.29 J8.11
  Bottom 0.203: IC3.7 48.76,40.96 v48.62,40.83
4RX0  (via drill 0.38)
  Top 0.61: J7.5 43.8,52.26 v43.8,53.53
  Bottom 0.203: IC3.34 51.3,58.49 48.88,56.07 46.34,56.07 45.07,56.07 43.8,54.8 v43.8,53.53
4SVN  (via drill 0.38)
  Top 0.203: J8.7 29.06,59.37 31.1,59.37 31.86,58.61 31.86,54.04 32.62,53.27 32.62,48.19 37.95,42.86 38.72,42.1 47.61,42.1 48.37,42.1 v49.64,40.83
  Bottom 0.203: IC3.5 51.42,42.37 51.42,40.57 50.91,40.07 50.4,40.07 v49.64,40.83
4SVP  (via drill 0.38)
  Top 0.203: J8.5 28.56,63.18 29.83,61.91 31.86,61.91 32.87,60.89 32.87,54.54 33.64,53.78 33.64,48.7 38.97,43.37 39.22,43.11 48.37,43.11 v49.38,44.13
  Bottom 0.203: IC3.4 52.57,43.74 52.18,44.13 v49.38,44.13
4TX0  (via drill 0.38)
  Top 0.61: J7.3 44.05,49.72 43.8,49.97 v43.8,50.99
  Bottom 0.203: IC3.35 52.57,58.35 49.26,55.05 48.88,55.05 45.57,55.05 45.07,54.54 45.07,52.26 v43.8,50.99
+3V3_1  (4 unrouted)
  Top 0.813: J15.4 22.71,65.96 J16.3 19.14,62.42 R16.2
+3V3_2  (via drill 0.38)
  Top 0.61: J2.4 40.49,22.79 41.76,21.52 41.76,9.84 43.25,8.35 C3.2 49.85,8.35 51.42,8.35 | 51.42,8.35 53.19,8.35 | C2.1 53.45,8.1 53.19,8.35 | 53.19,8.35 54.79,8.35 R1.2 | v55.73,25.08 55.73,14.92 54.84,14.03 J1.2 51.42,8.35 | U1.5 52.46,31.97 v52.43,31.94
  Bottom 0.61: IC1.3V3 53.71,5.03 C2.1 | v55.73,25.08 55.73,28.64 v52.43,31.94
+3V3_3  (via drill 0.38)
  Top 0.61: R6.2 15.09,1.93 4.97,1.93 C6.1 2.39,4.51 2.39,9.88 U2.5 2.97,9.91 3.66,10.6 v3.66,15.55 3.66,26.1 4.13,26.57 C7.2 7.69,26.57 7.73,26.6 | J6.2 7.6,23.18 7.73,23.3 7.73,26.6 | 7.73,26.6 7.73,27.37 | 7.73,27.37 7.73,32.48 | 7.98,27.11 7.73,27.37 | 7.73,32.48 18.87,32.48 19.67,31.68 19.67,27.37 19.41,27.11 v17.63,27.11 17.6,27.15 R5.1 | R4.2 7.73,32.48
  Bottom 0.61: v17.63,27.11 16.26,27.11 IC2.VCC | v3.66,15.55 17.51,15.55 J4.4
+3V3_4  (via drill 0.38)
  Top 0.61: C11.2 54.97,49.21 | 54.97,49.21 54.97,58.1 | 54.97,58.1 v54.97,63.18 | U3.5 54.75,58.32 54.97,58.1 | J7.2 39.22,47.18 41,45.4 48.37,45.4 48.88,45.91 49.89,45.91 50.4,45.4 51.16,44.64 54.97,44.64 | 54.97,49.21 54.97,46.16 | 54.97,46.16 54.97,44.64 | 54.97,44.64 54.97,43.11 | 54.97,43.11 54.97,41.34 C15.1 | C16.2 54.97,43.11 | R9.2 54.97,46.16
  Bottom 0.61: J8.4 30.59,65.72 32.11,67.24 35.41,67.24 37.19,69.02 46.59,69.02 47.61,68.01 47.61,64.7 49.13,63.18 v54.97,63.18 | C15.1 54.46,39.81 55.11,40.45 IC3.2
+5V_1  (2 unrouted)
  Top 0.813: J11.2 5.03,50.48 K2.R2 D2.C | K1.R2 D1.C
+5V_2
  Top 0.61: R2.1 54.02,27.52 U1.1 51.92,29.37 50.68,29.37 50.18,29.87 49.13,30.92 45.07,30.92 44.81,30.67 42.53,30.67 42.27,30.67 41,30.67 40.24,30.67 | C5.2 40.53,31.14 40.53,30.96 40.24,30.67 | 40.24,30.67 37.45,30.67 C4.1
  Bottom 0.406: 45.57,28.13 45.8,28.35 J3.VBUS
  Bottom 0.61: J2.6 39.48,22.79 39.48,28.13 | 39.48,28.13 C4.1 | 45.57,28.13 39.48,28.13
+5V_3  (via drill 0.38)
  Top 0.61: R7.1 7.22,10.09 | 7.22,10.09 7.22,9.84 | 7.22,9.84 C10.1 | U2.1 7.15,9.91 7.22,9.84 | v19.97,7.55 19.97,10.09 | 19.97,10.09 19.97,12.18 J4.6 | 7.22,10.09 19.97,10.09
  Bottom 0.406: J5.VBUS 12.33,7.08 12.55,7.3
  Bottom 0.61: 12.55,7.3 12.61,7.3 13.62,8.32 19.21,8.32 v19.97,7.55 19.97,7.5 21.7,5.78 C8.1
+5V_4  (via drill 0.38)
  Top 0.61: U3.1 50.08,62.67 | R8.1 50.08,62.67 | v50.29,64.58 46.72,64.58 C12.1 | C14.1 50.67,64.96 v50.29,64.58 | 50.08,62.67 50.08,64.37 v50.29,64.58
  Bottom 0.406: J9.VBUS 51.13,65.42 v50.29,64.58
  Bottom 0.61: J8.6 31.86,63.18 34.4,65.72 45.57,65.72 C12.1
GND
  pour Top: 57,0 57,70 0,70 0,0
  pour Bottom: 57,0 57,70 0,70 0,0
IN2_A
  Bottom 0.203: SJ1.2 33.64,9.33 J2.13
IN2_LED
  Bottom 0.203: SJ1.3 33.64,13.4 J2.11
IN3_A
  Bottom 0.61: SJ3.2 25,24.83 J4.13
IN3_DHT
  Bottom 0.203: J4.8 22.46,16.44 23.73,15.17 26.27,15.17 SJ2.1
IN3_LED
  Bottom 0.61: SJ3.3 25,20.76 J4.11
IN_L  (2 unrouted)
N  (2 unrouted)
N$1  (via drill 0.38)
  Top 0.61: v6.2,29.65 R4.1
  Bottom 0.61: IC2.CH_PD 6.18,29.63 v6.2,29.65
N$2
  Top 0.813: T1.C 5.56,58.35 D1.A K1.R1
N$3
  Top 0.813: T1.B 13.21,59.3 R11.2 R10.1
N$6
  Top 0.813: K2.R1 D2.A 6.58,43.88 T2.C
N$7
  Top 0.813: R15.1 11.79,46.63 | 11.79,46.63 R13.2 | T2.B 11.62,46.46 11.79,46.63
N$10
  Top 0.813: R12.2 14.84,47.05 R14.2
N$15
  Top 0.813: C17.1 13.28,64.82 IC5.VCC 15.31,62.56 R16.1
OUT_L1  (1 unrouted)
OUT_L2  (1 unrouted)
RET
  cutout Bottom: 56,34 30,34 30,1 29,1 29,34 2,34 2,35 56,35
  cutout Top: 2,35 56,35 56,34 30,34 30,1 29,1 29,34 2,34

### Text on the board
tPlace: EN GD VP VN 23 35 26 18 25 04 13 15 27 | EN GD SQ FR SD LD _A _C _E R1 B1 G2 CK | PG 3V 5V DH SC SN _B _D OE G1 R2 B2 LT | 0 3V 5V 34 22 02 05 19 33 12 14 21 32 | 0 | RX | TX | G | 3V | RST | 3V | G | 0 | EN GD 02 01 05 04 04 10 | EN GD SQ FR SD LD _A _C | PG 3V 5V DH SC SN _B _D | 09 3V 5V 00 06 03 08 07 | RX | TX | RST | RST | RX | TX | 0 | G | 3V | 00 3V 5V DH 05 15 16 13 | PG 3V 5V DH SC SN _B _D | EN GD SQ FR SD LD _A _C | EN GD 12 A0 04 LD _A 14